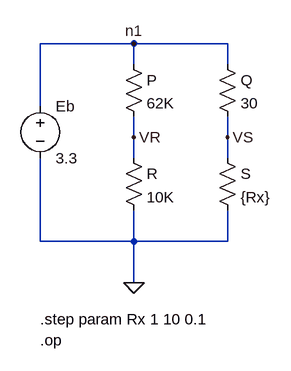
[diagram p0: schematic WheatStone_Bridge.asc]
WheatStone_Bridge.asc, the LTspice schematic file:
Version 4
SHEET 1 880 680
WIRE 112 80 -32 80
WIRE 256 80 112 80
WIRE 112 112 112 80
WIRE 256 112 256 80
WIRE -32 176 -32 80
WIRE 112 224 112 192
WIRE 256 224 256 192
WIRE 112 256 112 224
WIRE 256 256 256 224
WIRE -32 384 -32 256
WIRE 112 384 112 336
WIRE 112 384 -32 384
WIRE 256 384 256 336
WIRE 256 384 112 384
WIRE 112 448 112 384
FLAG 112 224 VR
FLAG 256 224 VS
FLAG 112 448 0
FLAG 112 80 n1
SYMBOL res 96 96 R0
SYMATTR InstName P
SYMATTR Value 62K
SYMATTR SpiceLine tol=1 pwr=1
SYMBOL res 240 96 R0
SYMATTR InstName Q
SYMATTR Value 30
SYMATTR SpiceLine tol=1 pwr=1
SYMBOL res 240 240 R0
SYMATTR InstName S
SYMATTR Value {Rx}
SYMATTR SpiceLine tol=1 pwr=1
SYMBOL res 96 240 R0
SYMATTR InstName R
SYMATTR Value 10K
SYMATTR SpiceLine tol=1 pwr=1
SYMBOL voltage -32 160 R0
WINDOW 123 0 0 Left 0
WINDOW 39 0 0 Left 0
SYMATTR InstName Eb
SYMATTR Value 3.3
TEXT -32 504 Left 2 !.step param Rx 1 10 0.1
TEXT -32 536 Left 2 !.op

The netlist it stands for:
* WheatStone_Bridge.asc
R§P n1 VR 62K tol=1 pwr=1
R§Q n1 VS 30 tol=1 pwr=1
R§S VS 0 {Rx} tol=1 pwr=1
R VR 0 10K tol=1 pwr=1
V§Eb n1 0 3.3
.step param Rx 1 10 0.1
.op
.backanno
.end